# EasyEDA Pro project Temp_Con_V116.eprj, schematic SENS_485

## Sheets
1 RTD-Sense: Board Name: TEMP_SENS_485; Create Date: 2025-01-22; Page Name: RTD-Sense; Project Name: Temp_Con_V116; Schematic Name: SENS_485; Update Date: 2025-01-28; Company: EasyEDA.com; Page Size: A4; Version: V1.0
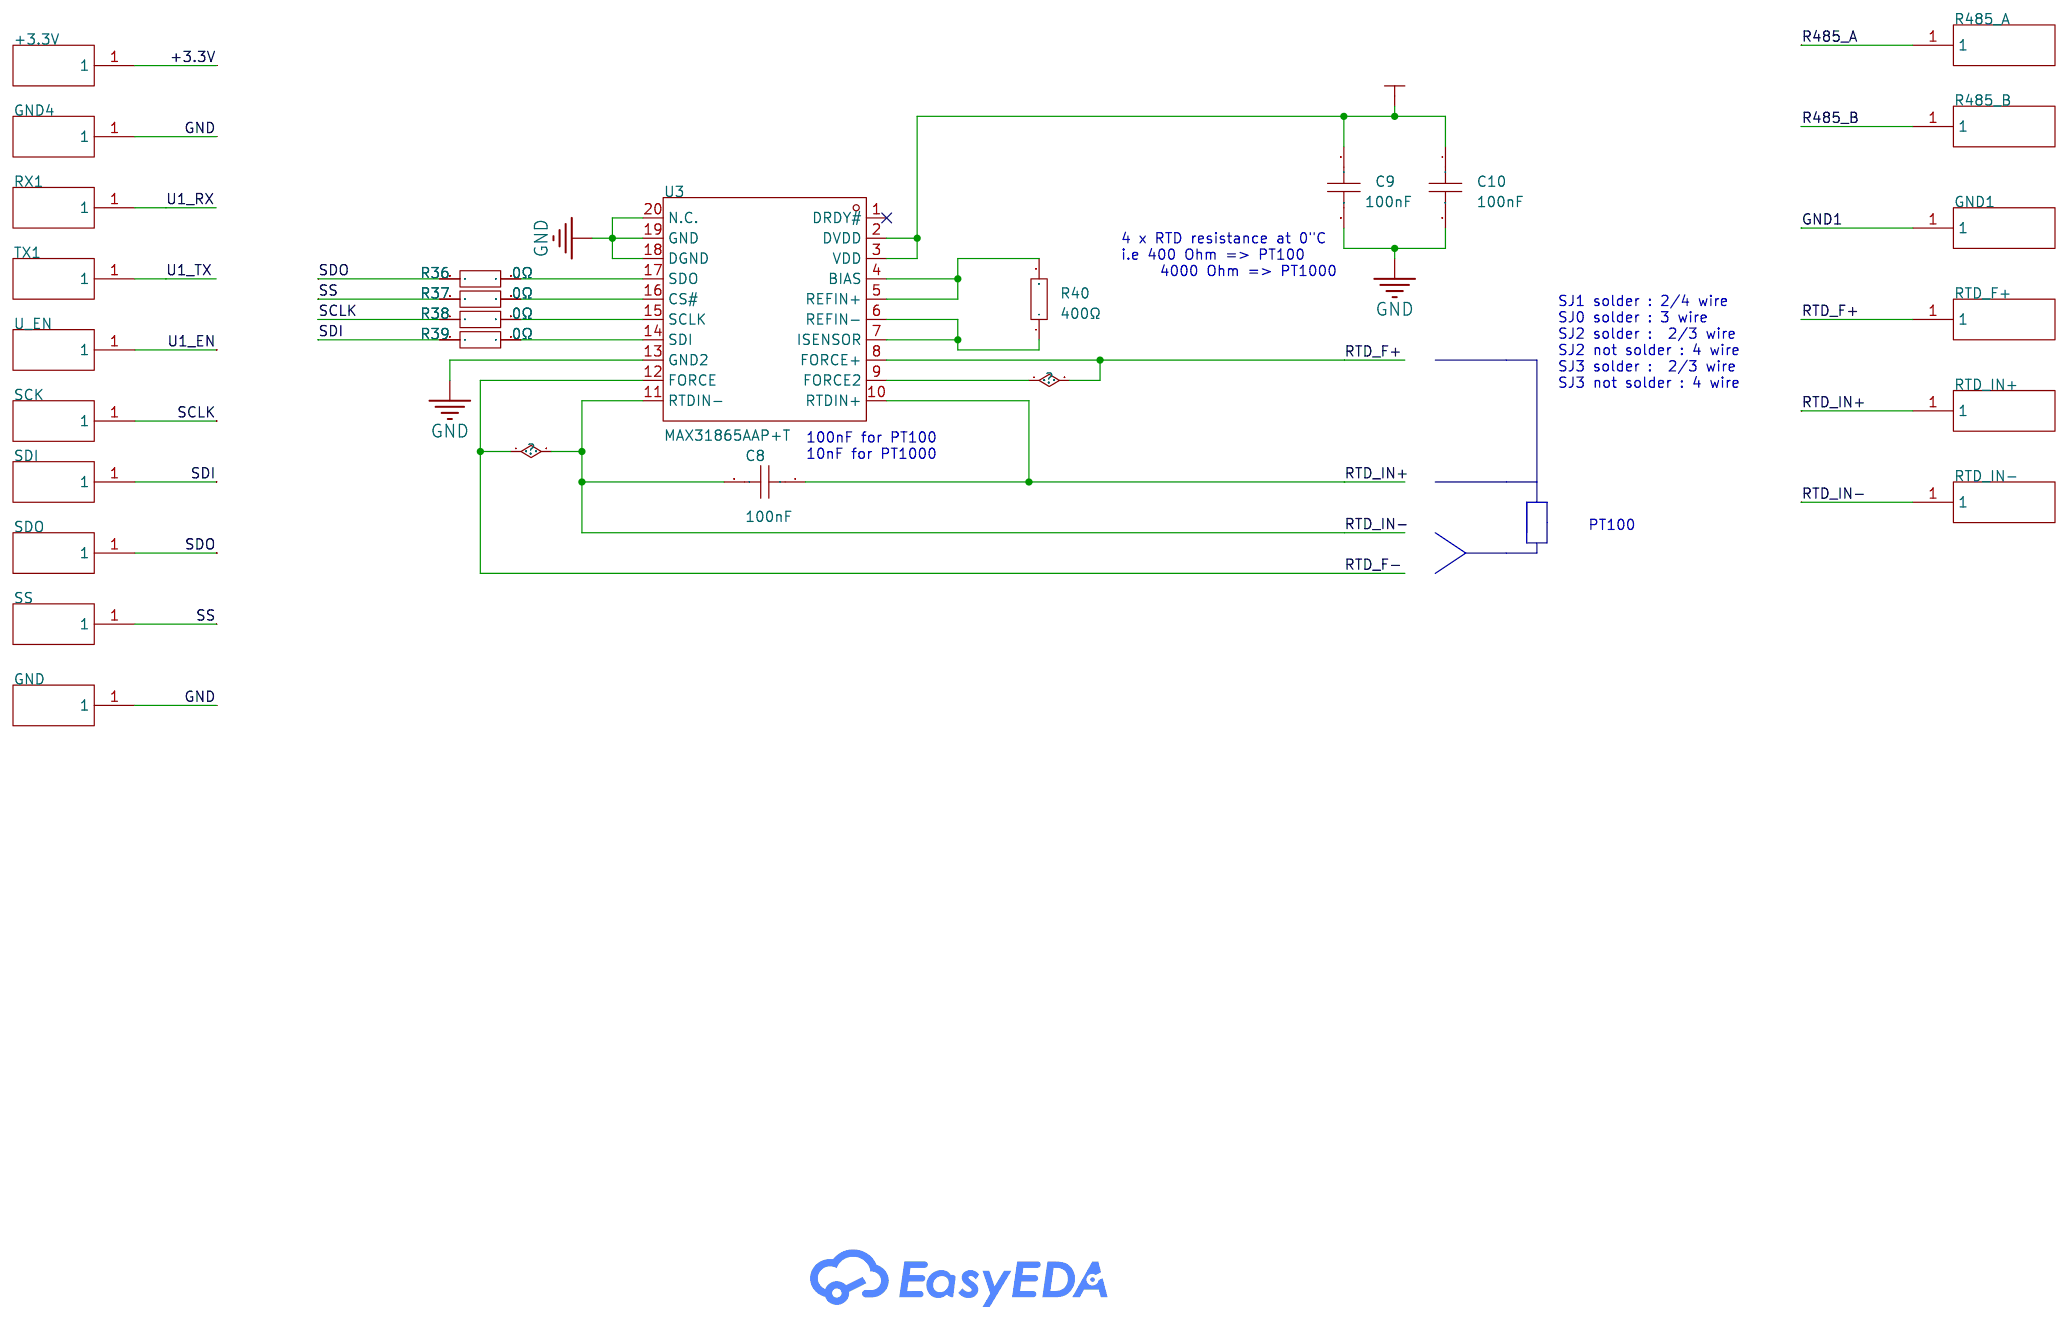
[diagram p1: RTD-Sense]
2 RS485: Page Name: RS485; Update Date: 2025-01-24
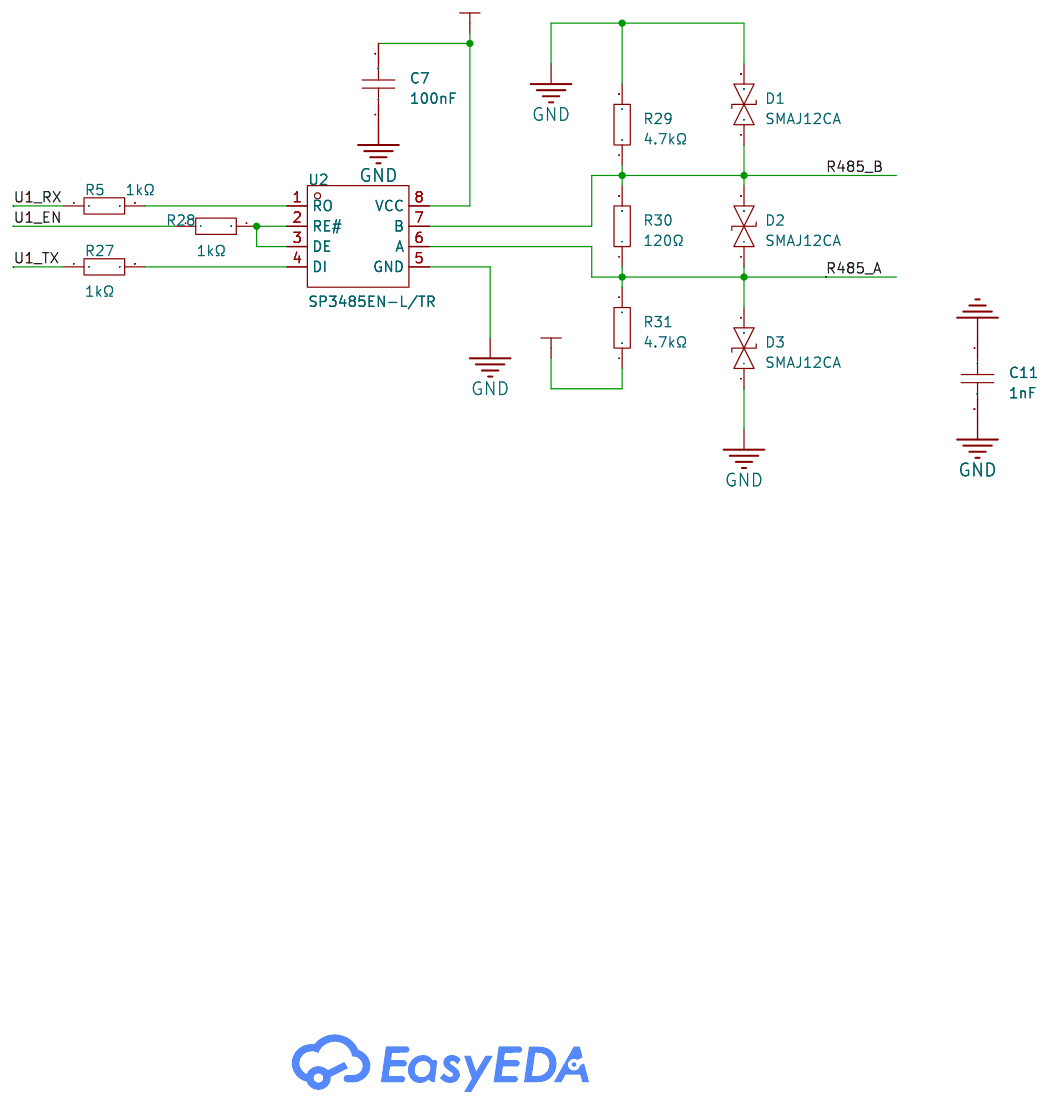
[diagram p2: RS485]

## Parts
sheet RS485
C7  100nF  [C0805]
C11  1nF  [C0805]
D1  SMAJ12CA  [SMA_L4.4-W2.6-LS5.0-BI]
D2  SMAJ12CA  [SMA_L4.4-W2.6-LS5.0-BI]
D3  SMAJ12CA  [SMA_L4.4-W2.6-LS5.0-BI]
R5  1kΩ  [R0805]
R27  1kΩ  [R0805]
R28  1kΩ  [R0805]
R29  4.7kΩ  [R0805]
R30  120Ω  [R0805]
R31  4.7kΩ  [R0805]
U2  SP3485EN-L/TR  [SOIC-8_L5.0-W4.0-P1.27-LS6.0-BL]
sheet RTD-Sense
+3.3V  -  [S_FT]  (no BOM)
C8  100nF  [C0805]
C9  100nF  [C0805]
C10  100nF  [C0805]
GND  -  [S_FT]  (no BOM)
GND1  -  [B_FT]  (no BOM)
GND4  -  [S_FT]  (no BOM)
R36  0Ω  [R0805]
R37  0Ω  [R0805]
R38  0Ω  [R0805]
R39  0Ω  [R0805]
R40  400Ω  [R0805]
R485_A  -  [B_FT]  (no BOM)
R485_B  -  [B_FT]  (no BOM)
RTD_F+  -  [B_FT]  (no BOM)
RTD_IN+  -  [B_FT]  (no BOM)
RTD_IN-  -  [B_FT]  (no BOM)
RX1  -  [S_FT]  (no BOM)
SCK  -  [S_FT]  (no BOM)
SDI  -  [S_FT]  (no BOM)
SDO  -  [S_FT]  (no BOM)
SS  -  [S_FT]  (no BOM)
TX1  -  [S_FT]  (no BOM)
U3  MAX31865AAP+T  [SSOP-20_L7.2-W5.3-P0.65-LS7.8-BL]
U_EN  -  [S_FT]  (no BOM)

## Library data of the parts
C7-C10 = CC0805KRX7R9BB104: LCSC Part Name: 100nF ±10% 50V; Supplier Part: C49678; Manufacturer: YAGEO(国巨); Supplier Footprint: 0805; JLCPCB Part Class: Basic Part; Datasheet: https://atta.szlcsc.com/upload/public/pdf/source/20180224/C181747_15194369449651363981.pdf; Supplier: LCSC; Tolerance: ±10%; Check: true
C11 = 0805B102K102CT: LCSC Part Name: 1nF ±10% 1kV; Supplier Part: C303890; Manufacturer: Walsin(华新科); Supplier Footprint: 0805; JLCPCB Part Class: Extended Part; Supplier: LCSC; Tolerance: ±10%
D1-D3 = SMAJ12CA_C152122: LCSC Part Name: 双向TVS 12V截止 20.1A峰值脉冲; Supplier Part: C152122; Manufacturer: BORN(伯恩半导体); Supplier Footprint: SMA(DO-214AC); JLCPCB Part Class: Extended Part; Datasheet: https://atta.szlcsc.com/upload/public/pdf/source/20190327/C152114_59D196591C1FC858E9F4FB19F8EA1A29.pdf; Supplier: LCSC; Reverse Stand-Off Voltage (Vrwm): 12V; Maximum Clamping Voltage: 19.9V; Peak Pulse Current (Ipp): 20.1A; Breakdown Voltage: 13.3V; Type: TVS; Check: true
R5 R27 R28 = RC0805FR-071KL: LCSC Part Name: 厚膜电阻 1kΩ ±1% 125mW; Supplier Part: C95781; Manufacturer: YAGEO(国巨); Supplier Footprint: 0805; JLCPCB Part Class: Extended Part; Datasheet: https://atta.szlcsc.com/upload/public/pdf/source/20170708/1499509500945.pdf; Supplier: LCSC; Type: Thick Film Resistors; Tolerance: ±1%; Temperature Coefficient: ±100ppm/℃; Operating Temperature Range: -55℃~+155℃; Check: true
R29 R31 = RC0805FR-074K7L: LCSC Part Name: 厚膜电阻 4.7kΩ ±1% 125mW; Supplier Part: C60816; Manufacturer: YAGEO(国巨); Supplier Footprint: 0805; JLCPCB Part Class: Extended Part; Datasheet: https://atta.szlcsc.com/upload/public/pdf/source/20180904/C276339_014E484F1DBA106FB92D45EABD5A1AC1.pdf; Supplier: LCSC; Type: Thick Film Resistors; Tolerance: ±1%; Temperature Coefficient: ±100ppm/℃; Operating Temperature Range: -55℃~+155℃; Check: true
R30 = RC0805FR-07120RL: LCSC Part Name: 厚膜电阻 120Ω ±1% 125mW; Supplier Part: C114245; Manufacturer: YAGEO(国巨); Supplier Footprint: 0805; JLCPCB Part Class: Extended Part; Datasheet: https://atta.szlcsc.com/upload/public/pdf/source/20180821/C275644_0D56F95EFF785E7D9A1FEF436B37DA78.pdf; Supplier: LCSC; Type: Thick Film Resistors; Tolerance: ±1%; Temperature Coefficient: ±100ppm/℃; Operating Temperature Range: -55℃~+155℃; Check: true
U2 = SP3485EN-L/TR: LCSC Part Name: SP3485 +3.3V低功耗半双工RS-485收发器，数据速率10Mbps; Supplier Part: C8963; Manufacturer: MaxLinear(迈凌); Supplier Footprint: SOIC-8; JLCPCB Part Class: Basic Part; Datasheet: https://atta.szlcsc.com/upload/public/pdf/source/20170601/1496285796963.pdf; Supplier: LCSC; Types: Transceiver; Number of Driver: 1; Number of receiver: 1; Supply Voltage: 3.3V; Data Rate: 10Mbps; Operating Temperature: -40℃~+85℃; Check: true
+3.3V GND GND4 RX1 SCK SDI SDO SS TX1 U_EN = S_TM
GND1 R485_A R485_B RTD_F+ RTD_IN+ RTD_IN- = B_TM
R36-R39 = RC0805JR-070RL: LCSC Part Name: 厚膜电阻 0Ω ±5% 125mW; Supplier Part: C96345; Manufacturer: YAGEO(国巨); Supplier Footprint: 0805; JLCPCB Part Class: Extended Part; Datasheet: https://atta.szlcsc.com/upload/public/pdf/source/20170708/1499509500945.pdf; Supplier: LCSC; Type: Thick Film Resistors; Tolerance: ±5%; Operating Temperature Range: -55℃~+155℃; Check: true
R40 = TR0805B400RP0525Z: LCSC Part Name: 薄膜电阻 400Ω ±0.1% 125mW; Supplier Part: C153298; Manufacturer: EVER OHMS(天二科技); Supplier Footprint: 0805; JLCPCB Part Class: Extended Part; Datasheet: https://atta.szlcsc.com/upload/public/pdf/source/20190527/C149900_32B1354086E9F6A772108AB7B2B7A514.pdf; Supplier: LCSC; Type: Thin Film Resistor; Tolerance: ±0.1%; Temperature Coefficient: ±25ppm/℃; Operating Temperature Range: -55℃~+155℃; Check: true
U3 = MAX31865AAP+T: Supplier Part: C779509; Manufacturer: ADI(亚德诺)/MAXIM(美信); Supplier Footprint: SSOP-20-208mil; JLCPCB Part Class: Extended Part; Datasheet: https://atta.szlcsc.com/upload/public/pdf/source/20190723/C404011_F7F4B1E2DB54BAF2C7538ADE86C8BDC0.pdf; Supplier: LCSC; Interface: SPI; differential input: Yes; number of channels: 1; Supply Voltage: 3V~3.6V; Integral nonlinearity: 1LSB; resolution: 15Bit; Operating Temperature: -40℃~+125℃; Check: true

## Nets
+3.3V: +3.3V.1 C7.2 C9.1 C10.1 R31.1 U2.8(VCC) U3.2(DVDD) U3.3(VDD)
GND: C7.1 C9.2 C10.2 C11.2 D1.2 D3.1 GND.1 GND4.1 R29.2 U2.5(GND) U3.13(GND2) U3.18(DGND) U3.19(GND) U3.20(N.C.)
GND1: C11.1 GND1.1
R485_A: D2.1 D3.2 R30.1 R31.2 R485_A.1 U2.6(A)
R485_B: D1.1 D2.2 R29.1 R30.2 R485_B.1 U2.7(B)
RTD_F+: RTD_F+.1 U3.8(FORCE+) U3.9(FORCE2)
RTD_F-: C8.2 RTD_IN-.1 U3.11(RTDIN-) U3.12(FORCE)
RTD_IN+: C8.1 RTD_IN+.1 U3.10(RTDIN+)
SCLK: R38.1 SCK.1
SDI: R39.1 SDI.1
SDO: R36.1 SDO.1
SS: R37.1 SS.1
U1_EN: R28.1 U_EN.1
U1_RX: R5.1 RX1.1
U1_TX: R27.1 TX1.1
$2N377: R36.2 U3.17(SDO)
$2N381: R37.2 U3.16(CS#)
$2N386: R38.2 U3.15(SCLK)
$2N391: R39.2 U3.14(SDI)
$2N592: R40.2 U3.4(BIAS) U3.5(REFIN+)
$2N609: R40.1 U3.6(REFIN-) U3.7(ISENSOR)
$3N638: R5.2 U2.1(RO)
$3N639: R28.2 U2.2(RE#) U2.3(DE)
$3N640: R27.2 U2.4(DI)

Not connected (* = marked no-connect by the designer): U3 1(DRDY#)*

## Notes on the sheets
sheet 1
- 4 x RTD resistance at 0"C
  i.e 400 Ohm => PT100
       4000 Ohm => PT1000
- SJ1 solder : 2/4 wire
  SJ0 solder : 3 wire
  SJ2 solder :  2/3 wire
  SJ2 not solder : 4 wire
  SJ3 solder :  2/3 wire
  SJ3 not solder : 4 wire
- 100nF for PT100
  10nF for PT1000
- PT100
